# Altium schematic sheet 2_MICROCONTROLADOR.SchDoc
size Tabloid; SheetNumber: 2; SheetTotal: 3; SPICEModelCacheCXJGCLTJ: <root> / <DocumentId>CXJGCLTJ</DocumentId> / </root>
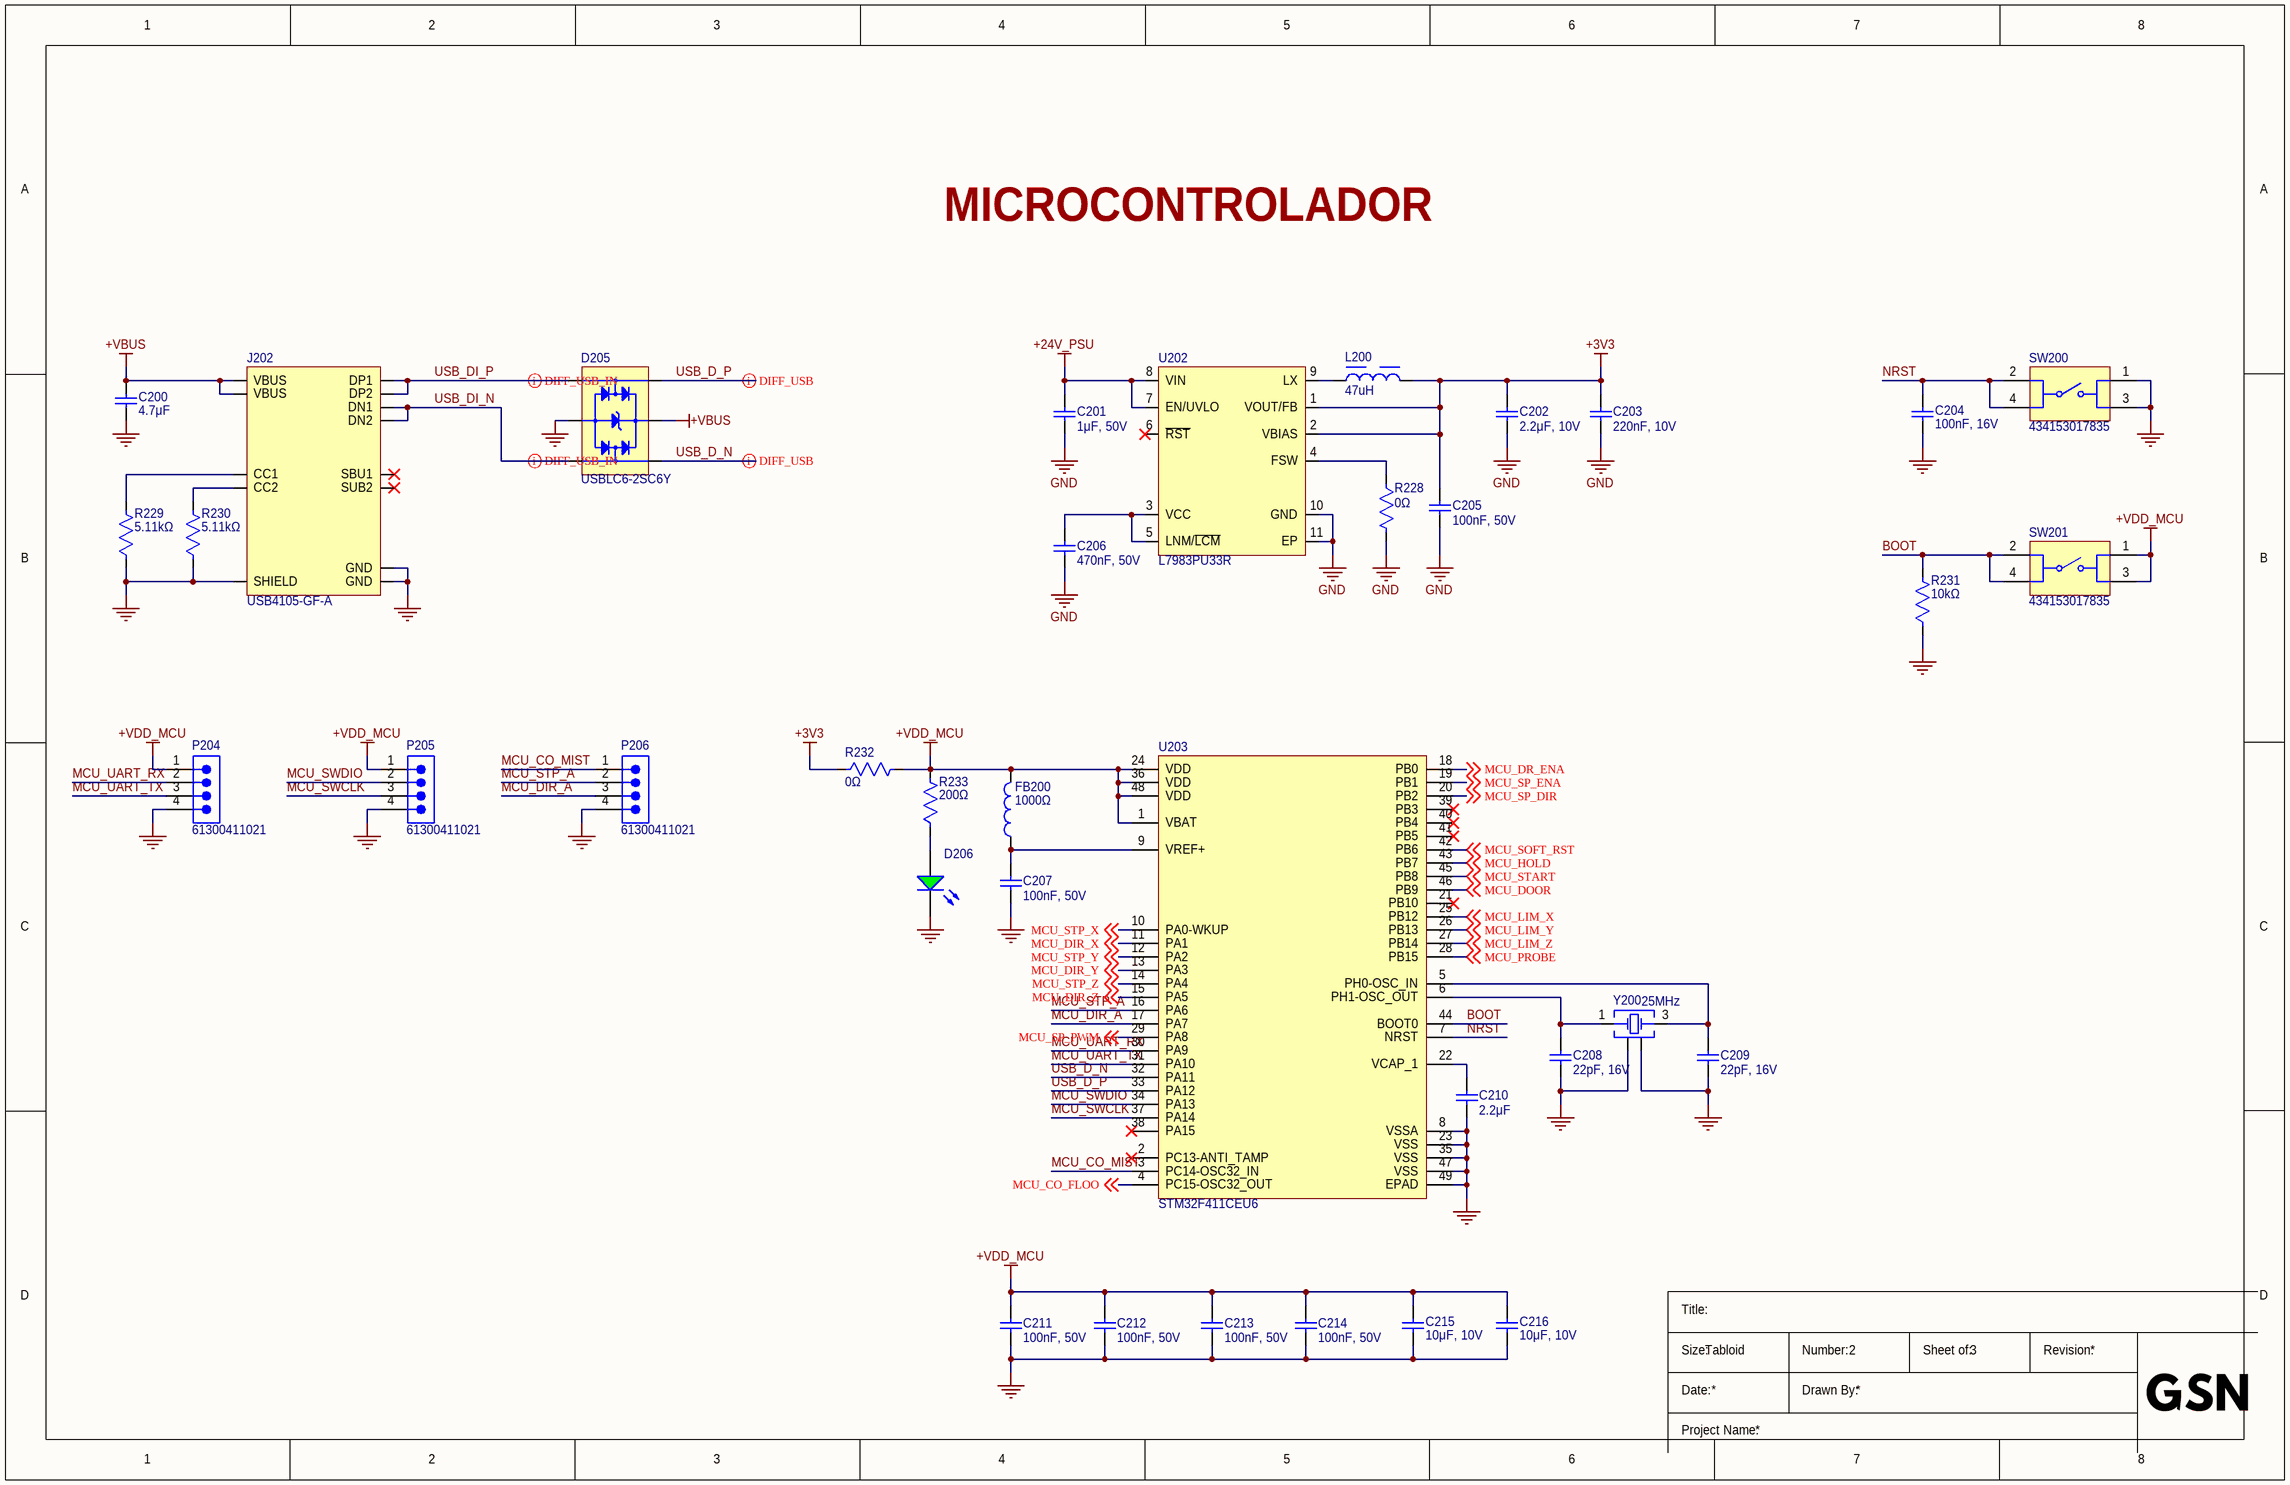
[diagram p0: 2_MICROCONTROLADOR.SchDoc]

## Parts
C200  4.7μF  [WCAP-CSGP_0805_L2W1.25H1.25]
C201  1μF, 50V  [WCAP-CSGP_0805_L2W1.25H1.25]
C202  2.2μF, 10V  [WCAP-CSGP_0603_L1.6W0.8H0.8_Wave]
C203  220nF, 10V  [WCAP-CSGP_0603_L1.6W0.8H0.8_Wave]
C204  100nF, 16V  [WCAP-CSGP_0603_L1.6W0.8H0.8_Wave]
C205  100nF, 50V  [WCAP-CSGP_0603_L1.6W0.8H0.8_Wave]
C206  470nF, 50V  [WCAP-CSGP_0805_L2W1.25H1.25]
C207  100nF, 50V  [WCAP-CSGP_0603_L1.6W0.8H0.8_Wave]
C208  22pF, 16V  [WCAP-CSGP_0603_L1.6W0.8H0.8_Wave]
C209  22pF, 16V  [WCAP-CSGP_0603_L1.6W0.8H0.8_Wave]
C210  2.2μF  [WCAP-CSGP_0603_L1.6W0.8H0.8_Wave]
C211  100nF, 50V  [WCAP-CSGP_0603_L1.6W0.8H0.8_Wave]
C212  100nF, 50V  [WCAP-CSGP_0603_L1.6W0.8H0.8_Wave]
C213  100nF, 50V  [WCAP-CSGP_0603_L1.6W0.8H0.8_Wave]
C214  100nF, 50V  [WCAP-CSGP_0603_L1.6W0.8H0.8_Wave]
C215  10μF, 10V  [WCAP-CSGP_0805_L2W1.25H1.25]
C216  10μF, 10V  [WCAP-CSGP_0805_L2W1.25H1.25]
D205  USBLC6-2SC6Y  [SOT-23-6]
D206  Bright Green, 2V, 140deg  [WL-SMCW_0603_150060xx75000]  (value not drawn)
FB200  1000Ω  [WE-CBF_0603_L1.6W0.8H0.8_HS_WB]
J202  USB4105-GF-A  [USB4105-GF-A]
L200  47uH  [WE-MAIA_3015]
P204  61300411021  [61300411021]
P205  61300411021  [61300411021]
P206  61300411021  [61300411021]
R228  0Ω  [0603-WAVE]
R229  5.11kΩ  [0603-WAVE]
R230  5.11kΩ  [0603-WAVE]
R231  10kΩ  [0603-WAVE]
R232  0Ω  [0805-WAVE]
R233  200Ω  [0603-WAVE]
SW200  434153017835  [434153017835]
SW201  434153017835  [434153017835]
U202  L7983PU33R  [10-WFDFN-EP]
U203  STM32F411CEU6  [UFQFN-48-7X7_EXPOSED_PAD]
Y200  25MHz  [WE-XTAL_CFPX-180]

## Nets
+3V3: C202.2 C203.2 C205.2 L200.2 R232.1 U202.1(VOUT/FB) U202.2(VBIAS)
+24V_PSU: C201.2 U202.7(EN/UVLO) U202.8(VIN)
+VBUS: C200.2 D205.5(VBUS) J202.A4_B9(VBUS) J202.B4_A9(VBUS)
+VDD_MCU: C211.2 C212.2 C213.2 C214.2 C215.2 C216.2 FB200.2 P204.1 P205.1 R232.2 R233.2 SW201.1 SW201.3 U203.1(VBAT) U203.24(VDD) U203.36(VDD) U203.48(VDD)
GND: C200.1 C201.1 C202.1 C203.1 C204.1 C205.1 C206.1 C207.1 C208.1 C209.1 C210.1 C211.1 C212.1 C213.1 C214.1 C215.1 C216.1 D205.2(GND) D206.1(K) J202.A1_B12(GND) J202.B1_A12(GND) J202.SH(SHIELD) P204.4 P205.4 P206.4 R228.2 R229.1 R230.1 R231.1 SW200.1 SW200.3 U202.10(GND) U202.11(EP) U203.8(VSSA) U203.23(VSS) U203.35(VSS) U203.47(VSS) U203.49(EPAD) Y200.2(GND&Lid) Y200.4(GND&Lid)
BOOT: R231.2 SW201.2 SW201.4 U203.44(BOOT0)
MCU_CO_FLOO: U203.4(PC15-OSC32_OUT) ; off-sheet MCU_CO_FLOO
MCU_CO_MIST: P206.1 U203.3(PC14-OSC32_IN)
MCU_DIR_A: P206.3 U203.17(PA7)
MCU_DIR_X: U203.11(PA1) ; off-sheet MCU_DIR_X
MCU_DIR_Y: U203.13(PA3) ; off-sheet MCU_DIR_Y
MCU_DIR_Z: U203.15(PA5) ; off-sheet MCU_DIR_Z
MCU_DOOR: U203.46(PB9) ; off-sheet MCU_DOOR
MCU_DR_ENA: U203.18(PB0) ; off-sheet MCU_DR_ENA
MCU_HOLD: U203.43(PB7) ; off-sheet MCU_HOLD
MCU_LIM_X: U203.25(PB12) ; off-sheet MCU_LIM_X
MCU_LIM_Y: U203.26(PB13) ; off-sheet MCU_LIM_Y
MCU_LIM_Z: U203.27(PB14) ; off-sheet MCU_LIM_Z
MCU_PROBE: U203.28(PB15) ; off-sheet MCU_PROBE
MCU_SOFT_RST: U203.42(PB6) ; off-sheet MCU_SOFT_RST
MCU_SP_DIR: U203.20(PB2) ; off-sheet MCU_SP_DIR
MCU_SP_ENA: U203.19(PB1) ; off-sheet MCU_SP_ENA
MCU_SP_PWM: U203.29(PA8) ; off-sheet MCU_SP_PWM
MCU_START: U203.45(PB8) ; off-sheet MCU_START
MCU_STP_A: P206.2 U203.16(PA6)
MCU_STP_X: U203.10(PA0-WKUP) ; off-sheet MCU_STP_X
MCU_STP_Y: U203.12(PA2) ; off-sheet MCU_STP_Y
MCU_STP_Z: U203.14(PA4) ; off-sheet MCU_STP_Z
MCU_SWCLK: P205.3 U203.37(PA14)
MCU_SWDIO: P205.2 U203.34(PA13)
MCU_UART_RX: P204.2 U203.30(PA9)
MCU_UART_TX: P204.3 U203.31(PA10)
NRST: C204.2 SW200.2 SW200.4 U203.7(NRST)
USB_D_N: D205.4(IO2) U203.32(PA11)
USB_D_P: D205.6(IO1) U203.33(PA12)
USB_DI_N: D205.3(IO2) J202.A7(DN1) J202.B7(DN2)
USB_DI_P: D205.1(IO1) J202.A6(DP1) J202.B6(DP2)
NetC206_2: C206.2 U202.3(VCC) U202.5(LNM/~{LCM})
NetC207_2: C207.2 FB200.1 U203.9(VREF+)
NetC208_2: C208.2 U203.6(PH1-OSC_OUT) Y200.1(Crystal)
NetC209_2: C209.2 U203.5(PH0-OSC_IN) Y200.3(Crystal)
NetC210_2: C210.2 U203.22(VCAP_1)
NetD206_2: D206.2(A) R233.1
NetJ202_A5: J202.A5(CC1) R229.2
NetJ202_B5: J202.B5(CC2) R230.2
NetL200_1: L200.1 U202.9(LX)
NetR228_1: R228.1 U202.4(FSW)

Not connected (* = marked no-connect by the designer): J202 A8(SBU1)* B8(SUB2)*; U202 6(~{RST})*; U203 2(PC13-ANTI_TAMP)* 21(PB10)* 38(PA15)* 39(PB3)* 40(PB4)* 41(PB5)*

## Layout directives
differential pair; differential pair class USB: USB_D_N, USB_D_P, USB_DI_N, USB_DI_P

## Notes on the sheet
- MICROCONTROLADOR
- Title:
- Size:
- Tabloid
- Number:
- Sheet of:
- Revision:
- Date:
- Project Name:
- Drawn By:

## Library data of the parts
C200 = 885012207053: WCAP-CSGP Multilayer Ceramic Chip Capacitor, General Purpose, size 0805, 4.7μF, 16V; Manufacturer: Wurth Elektronik; Case/Size Code: 0805; Capacitance: 4.7uF; Capacitance Tolerance: +/-10%; Ceramic Type: X7R; Dissipation Factor: 10%; Insulation Resistance: 0.02Gohm; Technical Reference: X7R0805475K016DFCT10000; Manufacturer Part Number: 885012207053; Category: Multilayer Ceramic Chip Capacitors; Match Code: WCAP-CSGP; ComponentLink1Description: Website Link; ComponentLink1URL: https://www.we-online.com/redexpert/article/885012207053?ad; ComponentLink2Description: Datasheet Link; ComponentLink2URL: https://www.we-online.com/redexpert/spec/885012207053?ad; Mount: Surface Mount; Packaging: Tape and Reel; Length: 2mm; Width: 1.25mm; Height: 1.25mm; Rated Voltage (DC): 16V; Operating Temperature Min: -55degC; Operating Temperature Max: 125degC
C201 = 885012207103R: WCAP-CSGP Multilayer Ceramic Chip Capacitor, General Purpose, size 0805, 1μF, 50V; Manufacturer: Wurth Elektronik; Case/Size Code: 0805; Capacitance: 1uF; Capacitance Tolerance: +/-10%; Ceramic Type: X7R; Dissipation Factor: 10%; Insulation Resistance: 0.1Gohm; Technical Reference: X7R0805105K050DFCT20000; Manufacturer Part Number: 885012207103R; Category: Multilayer Ceramic Chip Capacitors; Match Code: WCAP-CSGP; ComponentLink1Description: Website Link; ComponentLink1URL: https://www.we-online.com/redexpert/article/885012207103R?ad; ComponentLink2Description: Datasheet Link; ComponentLink2URL: https://www.we-online.com/redexpert/spec/885012207103R?ad; Mount: Surface Mount; Operating Temperature Min: -55degC; Operating Temperature Max: 125degC; Packaging: Tape and Reel; Length: 2mm; Width: 1.25mm; Height: 1.25mm; Rated Voltage (DC): 50V
C202 = 885012206027: WCAP-CSGP Multilayer Ceramic Chip Capacitor, General Purpose, size 0603, 2.2μF, 10V; Manufacturer: Wurth Elektronik; Case/Size Code: 0603; Capacitance: 2.2uF; Capacitance Tolerance: +/-10%; Ceramic Type: X7R; Dissipation Factor: 10%; Insulation Resistance: 0.02Gohm; Technical Reference: X7R0603225K010DFCT10000; Manufacturer Part Number: 885012206027; Category: Multilayer Ceramic Chip Capacitors; Match Code: WCAP-CSGP; ComponentLink1Description: Website Link; ComponentLink1URL: https://www.we-online.com/redexpert/article/885012206027?ad; ComponentLink2Description: Datasheet Link; ComponentLink2URL: https://www.we-online.com/redexpert/spec/885012206027?ad; Mount: Surface Mount; Operating Temperature Min: -55degC; Operating Temperature Max: 125degC; Packaging: Tape and Reel; Length: 1.6mm; Width: 0.8mm; Height: 0.8mm; Rated Voltage (DC): 10V
C203 = 885012206022: WCAP-CSGP Multilayer Ceramic Chip Capacitor, General Purpose, size 0603, 220nF, 10V; Manufacturer: Wurth Elektronik; Case/Size Code: 0603; Capacitance Tolerance: +/-10%; Ceramic Type: X7R; Dissipation Factor: 5%; Insulation Resistance: 2.3Gohm; Technical Reference: X7R0603224K010DFCT10000; Manufacturer Part Number: 885012206022; Category: Multilayer Ceramic Chip Capacitors; Match Code: WCAP-CSGP; ComponentLink1Description: Website Link; ComponentLink1URL: https://www.we-online.com/redexpert/article/885012206022?ad; ComponentLink2Description: Datasheet Link; ComponentLink2URL: https://www.we-online.com/redexpert/spec/885012206022?ad; Mount: Surface Mount; Operating Temperature Min: -55degC; Operating Temperature Max: 125degC; Packaging: Tape and Reel; Length: 1.6mm; Width: 0.8mm; Height: 0.8mm; Capacitance: 220nF; Rated Voltage (DC): 10V
C204 = 885012206046: WCAP-CSGP Multilayer Ceramic Chip Capacitor, General Purpose, size 0603, 100nF, 16V; Manufacturer: Wurth Elektronik; Case/Size Code: 0603; Capacitance Tolerance: +/-10%; Ceramic Type: X7R; Dissipation Factor: 3.5%; Insulation Resistance: 5Gohm; Technical Reference: X7R0603104K016DFCT10000; Manufacturer Part Number: 885012206046; Category: Multilayer Ceramic Chip Capacitors; Match Code: WCAP-CSGP; ComponentLink1Description: Website Link; ComponentLink1URL: https://www.we-online.com/redexpert/article/885012206046?ad; ComponentLink2Description: Datasheet Link; ComponentLink2URL: https://www.we-online.com/redexpert/spec/885012206046?ad; Mount: Surface Mount; Packaging: Tape and Reel; Length: 1.6mm; Width: 0.8mm; Height: 0.8mm; Capacitance: 100nF; Rated Voltage (DC): 16V; Operating Temperature Min: -55degC; Operating Temperature Max: 125degC
C205 C207 C211-C214 = 885012206095: WCAP-CSGP Multilayer Ceramic Chip Capacitor, General Purpose, size 0603, 100nF, 50V; Manufacturer: Wurth Elektronik; Case/Size Code: 0603; Capacitance Tolerance: +/-10%; Ceramic Type: X7R; Dissipation Factor: 3%; Insulation Resistance: 5Gohm; Technical Reference: X7R0603104K050DFCT10000; Manufacturer Part Number: 885012206095; Category: Multilayer Ceramic Chip Capacitors; Match Code: WCAP-CSGP; ComponentLink1Description: Website Link; ComponentLink1URL: https://www.we-online.com/redexpert/article/885012206095?ad; ComponentLink2Description: Datasheet Link; ComponentLink2URL: https://www.we-online.com/redexpert/spec/885012206095?ad; Mount: Surface Mount; Operating Temperature Min: -55degC; Operating Temperature Max: 125degC; Packaging: Tape and Reel; Length: 1.6mm; Width: 0.8mm; Height: 0.8mm; Capacitance: 100nF; Rated Voltage (DC): 50V
C206 = 885012207102: WCAP-CSGP Multilayer Ceramic Chip Capacitor, General Purpose, size 0805, 470nF, 50V; Manufacturer: Wurth Elektronik; Case/Size Code: 0805; Capacitance Tolerance: +/-10%; Ceramic Type: X7R; Dissipation Factor: 3%; Insulation Resistance: 1.1Gohm; Technical Reference: X7R0805474K050DFCT10000; Manufacturer Part Number: 885012207102; Category: Multilayer Ceramic Chip Capacitors; Match Code: WCAP-CSGP; ComponentLink1Description: Website Link; ComponentLink1URL: https://www.we-online.com/redexpert/article/885012207102?ad; ComponentLink2Description: Datasheet Link; ComponentLink2URL: https://www.we-online.com/redexpert/spec/885012207102?ad; Mount: Surface Mount; Operating Temperature Min: -55degC; Operating Temperature Max: 125degC; Packaging: Tape and Reel; Length: 2mm; Width: 1.25mm; Height: 1.25mm; Capacitance: 470nF; Rated Voltage (DC): 50V
C208 C209 = 885012006019: WCAP-CSGP Multilayer Ceramic Chip Capacitor, General Purpose, size 0603, 22pF, 16V; Manufacturer: Wurth Elektronik; Case/Size Code: 0603; Capacitance Tolerance: +/-5%; Ceramic Type: NP0; Insulation Resistance: 10Gohm; Q Factor: 840; Technical Reference: NP00603220J016DFCT10000; Manufacturer Part Number: 885012006019; Category: Multilayer Ceramic Chip Capacitors; Match Code: WCAP-CSGP; ComponentLink1Description: Website Link; ComponentLink1URL: https://www.we-online.com/redexpert/article/885012006019?ad; ComponentLink2Description: Datasheet Link; ComponentLink2URL: https://www.we-online.com/redexpert/spec/885012006019?ad; Mount: Surface Mount; Operating Temperature Min: -55degC; Operating Temperature Max: 125degC; Packaging: Tape and Reel; Length: 1.6mm; Width: 0.8mm; Height: 0.8mm; Capacitance: 22pF; Rated Voltage (DC): 16V
C210 = 885012106004: WCAP-CSGP Multilayer Ceramic Chip Capacitor, General Purpose, size 0603, 2.2μF, 6.3V; Manufacturer: Wurth Elektronik; Case/Size Code: 0603; Capacitance: 2.2uF; Capacitance Tolerance: +/-20%; Ceramic Type: X5R; Dissipation Factor: 10%; Insulation Resistance: 0.05Gohm; Technical Reference: X5R0603225M6R3DFCT10000; Manufacturer Part Number: 885012106004; Category: Multilayer Ceramic Chip Capacitors; Match Code: WCAP-CSGP; ComponentLink1Description: Website Link; ComponentLink1URL: https://www.we-online.com/redexpert/article/885012106004?ad; ComponentLink2Description: Datasheet Link; ComponentLink2URL: https://www.we-online.com/redexpert/spec/885012106004?ad; Mount: Surface Mount; Packaging: Tape and Reel; Length: 1.6mm; Width: 0.8mm; Height: 0.8mm; Rated Voltage (DC): 6.3V; Operating Temperature Min: -55degC; Operating Temperature Max: 85degC
C215 C216 = 885012207026: WCAP-CSGP Multilayer Ceramic Chip Capacitor, General Purpose, size 0805, 10μF, 10V; Manufacturer: Wurth Elektronik; Case/Size Code: 0805; Capacitance: 10uF; Capacitance Tolerance: +/-10%; Ceramic Type: X7R; Dissipation Factor: 10%; Insulation Resistance: 0.01Gohm; Technical Reference: X7R0805106K010DFCT10000; Manufacturer Part Number: 885012207026; Category: Multilayer Ceramic Chip Capacitors; Match Code: WCAP-CSGP; ComponentLink1Description: Website Link; ComponentLink1URL: https://www.we-online.com/redexpert/article/885012207026?ad; ComponentLink2Description: Datasheet Link; ComponentLink2URL: https://www.we-online.com/redexpert/spec/885012207026?ad; Mount: Surface Mount; Packaging: Tape and Reel; Length: 2mm; Width: 1.25mm; Height: 1.25mm; Rated Voltage (DC): 10V; Operating Temperature Min: -55degC; Operating Temperature Max: 125degC
D205 = USBLC6-2SC6Y: TVS DIODE 5.25VWM 17VC SOT23-6; Manufacturer: STMicroelectronics; Breakdown Voltage: 6V; Value: 2.5pF; Clamping Voltage: 17V; Direction: Unidirectional; Element Configuration: Dual; ESD Protection: Yes; Forward Voltage: 860mV; Leakage Current: 150nA; Max Junction Temperature (Tj): 150°C; Number of Bidirectional Channels: 2; Number of Elements: 1; Operating Supply Voltage: 1.1V; Peak Pulse Current: 5A; Reverse Standoff Voltage: 5.25V; ESR: 330Ω; Test Current: 1mA; Supplier: DigiKey; Supplier Part Number: 497-11882-1-ND; Manufacturer Part Number: USBLC6-2SC6Y; RoHS: Compliant; Category: TVS Diodes; Stock: 64605; Pricing: 1=0.46, 10=0.298, 100=0.211, 500=0.164, 1000=0.144 (USD); Case/Package: SOT-23-6; China RoHS: Compliant; Depth: 1.75mm; Height: 1.45mm; Lead Free: Lead Free; Length: 3mm; Lifecycle Status: Production; Max Operating Temperature: 150°C; Max Reverse Leakage Current: 150nA; Min Breakdown Voltage: 6V; Min Operating Temperature: -40°C; Mounting Technology: Surface Mount; Number of Channels: 2; Pins: 6; Number of Terminals: 6; Packaging: Tape and Reel; Peak Reverse Current: 150nA; Polarity: Unidirectional; Power Line Protection: Yes; Radiation Hardening: No; REACH SVHC: Yes; Schedule B: 8536300000, 8536300000|8536300000|8536300000|8536300000|8536300000; Termination: SMD/SMT; Width: 1.75mm; ComponentLink1URL: https://datasheet.octopart.com:443/USBLC6-2SC6Y-STMicroelectronics-datasheet-12533815.pdf?src-supplier=ODG+(Origin+Data+Global); ComponentLink1Description: https://datasheet.octopart.com:443/USBLC6-2SC6Y-STMicroelectronics-datasheet-12533815.pdf?src-supplier=ODG+(Origin+Data+Global); ComponentLink2URL: https://datasheet.octopart.com:443/USBLC6-2SC6Y-STMicroelectronics-datasheet-13733956.pdf?src-supplier=STMicroelectronics; ComponentLink2Description: https://datasheet.octopart.com:443/USBLC6-2SC6Y-STMicroelectronics-datasheet-13733956.pdf?src-supplier=STMicroelectronics; ComponentLink3URL: https://datasheet.octopart.com:443/USBLC6-2SC6Y-STMicroelectronics-datasheet-10412581.pdf?src-supplier=Factory+Futures; ComponentLink3Description: https://datasheet.octopart.com:443/USBLC6-2SC6Y-STMicroelectronics-datasheet-10412581.pdf?src-supplier=Factory+Futures; ComponentLink4URL: https://datasheet.octopart.com:443/USBLC6-2SC6Y-STMicroelectronics-datasheet-525477.pdf?src-supplier=Factory+Futures; ComponentLink4Description: https://datasheet.octopart.com:443/USBLC6-2SC6Y-STMicroelectronics-datasheet-525477.pdf?src-supplier=Factory+Futures
D206 = 150060VS75000: WL-SMCW Mono-color Chip LED Waterclear, SMT, size 0603, Bright Green, 2V, 140°; Manufacturer: Wurth Elektronik; Case/Size Code: 0603; Chip Technology: AlInGaP; Dominant Wavelength: 570nm; Luminous Intensity: 40mcd; Peak Wavelength: 572nm; Manufacturer Part Number: 150060VS75000; Category: Signal LEDs; Match Code: WL-SMCW; ComponentLink1Description: Website Link; ComponentLink1URL: https://www.we-online.com/redexpert/article/150060VS75000?ad; ComponentLink2Description: Datasheet Link; ComponentLink2URL: https://www.we-online.com/redexpert/spec/150060VS75000?ad; Mount: Surface Mount; Packaging: Tape and Reel; Length: 1.6mm; Width: 0.8mm; Height: 0.7mm; Emitting Color: Bright Green; Forward Voltage: 2V; Viewing Angle: 140deg; Operating Temperature Min: -40degC; Operating Temperature Max: 85degC
FB200 = 74279266: WE-CBF SMT EMI Suppression Ferrite Bead, size 0603, 1000Ω, 0.65A; Manufacturer: Wurth Elektronik; Case/Size Code: 0603; DC Resistance Max: 0.6Ω; Impedance Max: 1350Ω; Impedance Max Test Condition: 140MHz; Type: Wide Band; Manufacturer Part Number: 74279266; Category: Ferrites for PCB Assembly; Match Code: WE-CBF; ComponentLink1Description: Website Link; ComponentLink1URL: https://www.we-online.com/redexpert/article/74279266?ad; ComponentLink2Description: Datasheet Link; ComponentLink2URL: https://www.we-online.com/redexpert/spec/74279266?ad; Mount: Surface Mount; Packaging: Tape and Reel; Length: 1.6mm; Width: 0.8mm; Height: 0.8mm; Impedance @100MHz: 1000Ω; Rated Current: 0.65A; Operating Temperature Min: -55degC; Operating Temperature Max: 125degC
J202 = USB4105-GF-A: CONN RCP USB2.0 TYP C 16P SMD RA; Manufacturer: Global Connector Technology; Contact Resistance: 50mΩ; Current Rating: 6.25A; Dielectric Material: Liquid Crystal Polymer; Gender: Receptacle; Insulation Resistance: 100MΩ; Number of Contacts: 16; Number of Ports: 1; Voltage Rating: 20V; Supplier: DigiKey; Supplier Part Number: 2073-USB4105-GF-ACT-ND; Manufacturer Part Number: USB4105-GF-A; RoHS: Compliant; Category: USB Connectors; Stock: 6325; Pricing: 1=0.78, 10=0.658, 25=0.6172, 50=0.5876, 100=0.5595, 250=0.5244 (USD); China RoHS: Compliant; Contact Gender: Female; Contact Material: Gold, Nickel; Height: 3.46mm; Lifecycle Status: Production; Max Operating Temperature: 85°C; Min Operating Temperature: -40°C; Pins: 24; Number of Rows: 1; Orientation: Horizontal; REACH SVHC: Yes; Shell Finish: Nickel; Shell Material: Stainless Steel; Terminal Pitch: 500µm; USB Standard: USB 2.0; ComponentLink1URL: https://datasheet.octopart.com:443/USB4105-GF-A-GCT-datasheet-166929323.pdf?src-supplier=SOS+electronic; ComponentLink1Description: https://datasheet.octopart.com:443/USB4105-GF-A-GCT-datasheet-166929323.pdf?src-supplier=SOS+electronic; ComponentLink2URL: https://datasheet.octopart.com:443/USB4105-GF-A-GCT-datasheet-188935996.pdf?src-supplier=TME; ComponentLink2Description: https://datasheet.octopart.com:443/USB4105-GF-A-GCT-datasheet-188935996.pdf?src-supplier=TME; ComponentLink3URL: https://datasheet.octopart.com:443/USB4105-GF-A-GCT-datasheet-188869076.pdf?src-supplier=TME; ComponentLink3Description: https://datasheet.octopart.com:443/USB4105-GF-A-GCT-datasheet-188869076.pdf?src-supplier=TME; ComponentLink4URL: https://datasheet.octopart.com:443/USB4105-GF-A-GCT-datasheet-166927665.pdf?src-supplier=TME; ComponentLink4Description: https://datasheet.octopart.com:443/USB4105-GF-A-GCT-datasheet-166927665.pdf?src-supplier=TME
L200 = 78438335470: WE-MAIA SMT Power Inductor, size 3015, 47uH, 0.5A, 2300mohm; Manufacturer: Wurth Elektronik; Case/Size Code: 3015; Saturation Current @ 10%: 0.75A; Saturation Current @ 30%: 1.5A; Self Resonant Frequency: 8MHz; Manufacturer Part Number: 78438335470; Category: Power Inductors; Match Code: WE-MAIA; ComponentLink1Description: Website Link; ComponentLink1URL: https://www.we-online.com/redexpert/article/78438335470?ad; ComponentLink2Description: Datasheet Link; ComponentLink2URL: https://www.we-online.com/redexpert/spec/78438335470?ad; Mount: Surface Mount; Operating Temperature Min: -40degC; Operating Temperature Max: 125degC; Packaging: Tape and Reel; Length: 3mm; Width: 3mm; Height: 1.5mm; Automotive: Yes; DC Resistance Max: 2300mohm; Inductance: 47uH; Rated Current: 0.5A
P204-P206 = 61300411021: WR-PHD Pin Header, THT, Angled, pitch 2.54mm, 1 Row, 4P; Manufacturer: Wurth Elektronik; Contact Resistance: 20mOhm; Rated Current: 3A; Working Voltage: 250V; Withstanding Voltage: 500V; Manufacturer Part Number: 61300411021; Category: Board-to-Board Connectors; Match Code: WR-PHD; ComponentLink1Description: Website Link; ComponentLink1URL: https://www.we-online.com/redexpert/article/61300411021?ad; ComponentLink2Description: Datasheet Link; ComponentLink2URL: https://www.we-online.com/redexpert/spec/61300411021?ad; Mount: Through Hole; Operating Temperature Min: -40degC; Operating Temperature Max: 105degC; Packaging: Bag; Gender: Pin Header; Number of Pins: 4; Number of Rows: 1; Orientation: Angled; Lead Pitch: 2.54mm
R228 = RC0603FR-070RL: RES 0 OHM 1% 1/10W 0603; Manufacturer: Yageo Group; Max Power Dissipation: 100mW; Temperature Coefficient: ±200ppm/°C; Voltage Rating (AC): 50V; Voltage Rating: 75V; Supplier Part Number: 311-0.0HRCT-ND; Manufacturer Part Number: RC0603FR-070RL; Value: 0Ω; Case Code (Imperial): 0603; Case Code (Metric): 1608; Case/Package: 0603; Category: Chip SMD Resistors; China RoHS: Non-Compliant; Composition: Thick Film; Contact Plating: Tin; Depth: 800µm; Features: Moisture Resistant; Height: 450µm; Lead Free: Lead Free; Length: 1.6mm; Lifecycle Status: Production; Max Operating Temperature: 155°C; Military Standard: Not; Min Operating Temperature: -55°C; Mounting Technology: Surface Mount; Number of Terminals: 2; Number of Terminations: 2; Packaging: Tape & Reel; Power Dissipation: 100mW; Power Rating: 100mW; Radiation Hardening: No; REACH SVHC: Yes; RoHS: Compliant; Supplier: DigiKey; Termination: SMD/SMT; Tolerance: 1%; Component Link Description: https://www.yageogroup.com/content/datasheet/asset/file/PYU-RC_GROUP_51_ROHS_L; Component Link URL: https://www.yageogroup.com/content/datasheet/asset/file/PYU-RC_GROUP_51_ROHS_L; Datasheet: https://www.yageogroup.com/content/datasheet/asset/file/PYU-RC_GROUP_51_ROHS_L; Voltage Rating (DC): 50V; Weight: 2.012816mg; Width: 800µm; Working Voltage: 75V
R229 R230 = RC0603FR-075K11L: RES 5.11K OHM 1% 1/10W 0603; Manufacturer: Yageo Group; Max Power Dissipation: 100mW; Temperature Coefficient: ±200ppm/°C; Voltage Rating (AC): 50V; Voltage Rating: 75V; Supplier Part Number: 311-5.11KHRCT-ND; Manufacturer Part Number: RC0603FR-075K11L; Value: 5.11kΩ; Case Code (Imperial): 0603; Case Code (Metric): 1608; Case/Package: 0603; Category: Chip SMD Resistors; China RoHS: Non-Compliant; Composition: Thick Film; Contact Plating: Tin; Depth: 800µm; Features: Moisture Resistant; Height: 450µm; Lead Free: Lead Free; Length: 1.6mm; Lifecycle Status: Production; Max Operating Temperature: 155°C; Military Standard: Not; Min Operating Temperature: -55°C; Mounting Technology: Surface Mount; Number of Terminals: 2; Number of Terminations: 2; Packaging: Tape & Reel; Power Dissipation: 100mW; Power Rating: 100mW; Radiation Hardening: No; REACH SVHC: Yes; RoHS: Compliant; Supplier: DigiKey; Termination: SMD/SMT; Tolerance: 1%; Component Link Description: https://www.yageogroup.com/content/datasheet/asset/file/PYU-RC_GROUP_51_ROHS_L; Component Link URL: https://www.yageogroup.com/content/datasheet/asset/file/PYU-RC_GROUP_51_ROHS_L; Datasheet: https://www.yageogroup.com/content/datasheet/asset/file/PYU-RC_GROUP_51_ROHS_L; Voltage Rating (DC): 50V; Weight: 2.012816mg; Width: 800µm; Working Voltage: 75V
R231 = RC0603FR-0710KL: RES 10K OHM 1% 1/10W 0603; Manufacturer: Yageo Group; Max Power Dissipation: 100mW; Temperature Coefficient: ±200ppm/°C; Voltage Rating (AC): 50V; Voltage Rating: 75V; Supplier Part Number: 311-10.0KHRCT-ND; Manufacturer Part Number: RC0603FR-0710KL; Value: 10kΩ; Case Code (Imperial): 0603; Case Code (Metric): 1608; Case/Package: 0603; Category: Chip SMD Resistors; China RoHS: Non-Compliant; Composition: Thick Film; Contact Plating: Tin; Depth: 800µm; Features: Moisture Resistant; Height: 450µm; Lead Free: Lead Free; Length: 1.6mm; Lifecycle Status: Production; Max Operating Temperature: 155°C; Military Standard: Not; Min Operating Temperature: -55°C; Mounting Technology: Surface Mount; Number of Terminals: 2; Number of Terminations: 2; Packaging: Tape & Reel; Power Dissipation: 100mW; Power Rating: 100mW; Radiation Hardening: No; REACH SVHC: Yes; RoHS: Compliant; Supplier: DigiKey; Termination: SMD/SMT; Tolerance: 1%; Component Link Description: https://www.yageogroup.com/content/datasheet/asset/file/PYU-RC_GROUP_51_ROHS_L; Component Link URL: https://www.yageogroup.com/content/datasheet/asset/file/PYU-RC_GROUP_51_ROHS_L; Datasheet: https://www.yageogroup.com/content/datasheet/asset/file/PYU-RC_GROUP_51_ROHS_L; Voltage Rating (DC): 50V; Weight: 2.012816mg; Width: 800µm; Working Voltage: 75V
R232 = RC0805FR-070RL: RES 0 OHM 1% 1/8W 0805; Manufacturer: Yageo Group; Power Dissipation: 125mW; Temperature Coefficient: 100ppm/°C; Voltage Rating: 150V; Supplier: DigiKey; Supplier Part Number: 311-0.0CRCT-ND; Manufacturer Part Number: RC0805FR-070RL; RoHS: Compliant; Category: Chip SMD Resistors; Stock: 748818; Pricing: 1=0.1, 10=0.017, 25=0.0144, 50=0.0124, 100=0.0109, 250=0.00916, 500=0.00808, 1000=0.00715 (USD); Case/Package: 0805; China RoHS: Non-Compliant; Composition: Thick Film; Contact Plating: Tin; Depth: 1.25mm; Height: 500µm; Lead Free: Lead Free; Length: 2mm; Lifecycle Status: Production; Max Operating Temperature: 155°C; Military Standard: Not; Min Operating Temperature: -55°C; Mounting Technology: Surface Mount; Number of Terminals: 2; Power Rating: 125mW; Radiation Hardening: No; REACH SVHC: Yes; Value: 0Ω; Tolerance: 1%; Width: 1.25mm; ComponentLink1URL: https://datasheet.octopart.com:443/RC0805FR-070RL-Yageo-datasheet-127823281.pdf?src-supplier=Upverter; ComponentLink1Description: https://datasheet.octopart.com:443/RC0805FR-070RL-Yageo-datasheet-127823281.pdf?src-supplier=Upverter; ComponentLink2URL: https://datasheet.octopart.com:443/RC0805FR-070RL-Yageo-datasheet-17879891.pdf?src-supplier=IHS; ComponentLink2Description: https://datasheet.octopart.com:443/RC0805FR-070RL-Yageo-datasheet-17879891.pdf?src-supplier=IHS; ComponentLink3URL: https://datasheet.octopart.com:443/RC0805FR-070RL-Yageo-datasheet-8330313.pdf?src-supplier=Burklin+Elektronik; ComponentLink3Description: https://datasheet.octopart.com:443/RC0805FR-070RL-Yageo-datasheet-8330313.pdf?src-supplier=Burklin+Elektronik; ComponentLink4URL: https://datasheet.octopart.com:443/RC0805FR-070RL-Yageo-datasheet-164759695.pdf?src-supplier=Future+Electronics; ComponentLink4Description: https://datasheet.octopart.com:443/RC0805FR-070RL-Yageo-datasheet-164759695.pdf?src-supplier=Future+Electronics; ComponentLink5URL: https://datasheet.octopart.com:443/RC0805FR-070RL-Yageo-datasheet-12592811.pdf?src-supplier=Future+Electronics; ComponentLink5Description: https://datasheet.octopart.com:443/RC0805FR-070RL-Yageo-datasheet-12592811.pdf?src-supplier=Future+Electronics; ComponentLink6URL: https://datasheet.octopart.com:443/RC0805FR-070RL-Yageo-datasheet-8324252.pdf?src-supplier=Future+Electronics; ComponentLink6Description: https://datasheet.octopart.com:443/RC0805FR-070RL-Yageo-datasheet-8324252.pdf?src-supplier=Future+Electronics; ComponentLink7URL: https://datasheet.octopart.com:443/RC0805FR-070RL-Yageo-datasheet-141265859.pdf?src-supplier=TME; ComponentLink7Description: https://datasheet.octopart.com:443/RC0805FR-070RL-Yageo-datasheet-141265859.pdf?src-supplier=TME; ComponentLink8URL: https://datasheet.octopart.com/RC0805FR-070RL-Yageo-datasheet-73766026.pdf; ComponentLink8Description: https://datasheet.octopart.com/RC0805FR-070RL-Yageo-datasheet-73766026.pdf; ComponentLink9URL: http://sigma.octopart.com:80/conflict_mineral_statement/Yageo-company-3.pdf?src-supplier=Compliance+Statements; ComponentLink9Description: http://sigma.octopart.com:80/conflict_mineral_statement/Yageo-company-3.pdf?src-supplier=Compliance+Statements; ComponentLink10URL: http://sigma.octopart.com:80/rohs_statement/Yageo-company-2.pdf?src-supplier=Compliance+Statements; ComponentLink10Description: http://sigma.octopart.com:80/rohs_statement/Yageo-company-2.pdf?src-supplier=Compliance+Statements
R233 = RC0603FR-07200RL: RES 200 OHM 1% 1/10W 0603; Manufacturer: Yageo Group; Max Power Dissipation: 100mW; Temperature Coefficient: ±200ppm/°C; Voltage Rating (AC): 50V; Voltage Rating: 75V; Supplier Part Number: 311-200HRCT-ND; Manufacturer Part Number: RC0603FR-07200RL; Value: 200Ω; Case Code (Imperial): 0603; Case Code (Metric): 1608; Case/Package: 0603; Category: Chip SMD Resistors; China RoHS: Non-Compliant; Composition: Thick Film; Contact Plating: Tin; Depth: 800µm; Features: Moisture Resistant; Height: 450µm; Lead Free: Lead Free; Length: 1.6mm; Lifecycle Status: Production; Max Operating Temperature: 155°C; Military Standard: Not; Min Operating Temperature: -55°C; Mounting Technology: Surface Mount; Number of Terminals: 2; Number of Terminations: 2; Packaging: Tape & Reel; Power Dissipation: 100mW; Power Rating: 100mW; Radiation Hardening: No; REACH SVHC: Yes; RoHS: Compliant; Supplier: DigiKey; Termination: SMD/SMT; Tolerance: 1%; Component Link Description: https://www.yageogroup.com/content/datasheet/asset/file/PYU-RC_GROUP_51_ROHS_L; Component Link URL: https://www.yageogroup.com/content/datasheet/asset/file/PYU-RC_GROUP_51_ROHS_L; Datasheet: https://www.yageogroup.com/content/datasheet/asset/file/PYU-RC_GROUP_51_ROHS_L; Voltage Rating (DC): 50V; Weight: 2.012816mg; Width: 800µm; Working Voltage: 75V
SW200 SW201 = 434153017835: WS-TASV J-Bend SMT Tact Switch, 3.5mm x 2.9mm x 1.7mm, SPST-NO, 350gf, 12V, 50mA; Manufacturer: Wurth Elektronik; Washable: No; Manufacturer Part Number: 434153017835; Category: Tact Switch; Match Code: WS-TASV; ComponentLink1Description: Website Link; ComponentLink1URL: https://www.we-online.com; ComponentLink2Description: Datasheet Link; ComponentLink2URL: https://www.we-online.com/components/products/datasheet/434153017835; Mount: Surface Mount; Operating Temperature Min: -40degC; Operating Temperature Max: 85degC; Packaging: Tape and Reel; Length: 3.5mm; Width: 2.9mm; Height: 1.7mm; Circuit: SPST-NO; Contact Material: Stainless Steel; Contact Plating: Silver; Operation Force: 350gf; Rated Current: 50mA; Rated Voltage (DC): 12V; Terminal Material: Copper Alloy; Terminal Plating: Silver
U202 = L7983PU33R: IC REG BUCK 3.3V 300MA 10DFN; Manufacturer: STMicroelectronics; Max Supply Voltage: 60V; Max Switching Frequency: 2.42MHz; Min Input Voltage: 3.5V; Min Output Voltage: 850mV; Nominal Supply Voltage: 24V; Number of Circuits: 1; Quiescent Current: 10µA; Synchronous Rectifier: Yes; Supplier: DigiKey; Supplier Part Number: 497-L7983PU33RCT-ND; Manufacturer Part Number: L7983PU33R; RoHS: Compliant; Category: Voltage Regulators - Switching; Stock: 4366; Pricing: 1=2.69, 10=2.001, 25=1.83, 100=1.6411, 250=1.55108, 500=1.5155 (USD); China RoHS: Compliant; Country of Origin: Mainland China; Export Control Classification Number (ECCN) Code: EAR99; Height - Seated (Max): 800µm; Harmonized Tariff Schedule (HTS) Code: 8542.39.00.60; Introduction Date: 2020-10-06; Length: 3mm; Lifecycle Status: Production; Max Operating Temperature: 150°C; Max Output current: 300mA; Max Output Voltage: 60V; Min Operating Temperature: -40°C; Nominal Output Voltage: 3.3V; Number of Terminals: 10; Output Current: 300mA; Packaging: Tape and Reel; REACH SVHC: Yes; Schedule B: 8542390000, 8542390000|8542390000|8542390000|8542390000|8542390000|8542390000|8542390000|8542390000|8542390000|8542390000|8542390000|8542390000|8542390000|8542390000|8542390000|8542390000|8542390000|8542390000|8542390000|8542390000|8542390000|8542390000|8542390000|85; Terminal Pitch: 500µm; Topology: Buck; Width: 3mm
U203 = STM32F411CEU6: IC MCU 32BIT 512KB FLSH 48UFQFPN; Manufacturer: STMicroelectronics; ADC Channels (Resolution): 10-Ch 12-Bit; Core Architecture: ARM Cortex-M4; Data Bus Width: 32b; EEPROM Memory Size: 0B; Frequency: 100MHz; Interface: SDIO, USB; Clock Frequency: 26MHz; Max Power Dissipation: 625mW; Max Supply Current: 34.5mA; Max Supply Voltage: 3.6V; Memory Format: FLASH; Min Supply Voltage: 1.7V; Nominal Supply Current: 1.8µA; Number of A/D Converters: 1; Number of ADC Channels: 16; Number of Channels: 10; Number of I2C Channels: 3; Number of I/Os: 36; Number of SPI Channels: 5; Number of Timers/Counters: 2; Operating Supply Voltage: 3.3V; Oscillator Type: Internal; Peripherals: POR; RAM Size: 128kB; Watchdog Timer: Yes; Supplier: DigiKey; Supplier Part Number: 497-14907-ND; Manufacturer Part Number: STM32F411CEU6; RoHS: Compliant; Category: Microcontrollers; Stock: 3816; Pricing: 1=6.18, 10=4.745, 25=4.386, 100=3.991, 260=3.79569, 520=3.68344, 1040=3.59105, 2600=3.49353 (USD); Case/Package: UFQFPN; China RoHS: Compliant; Flash Memory Size: 512kB; Height - Seated (Max): 600µm; Lead Free: Lead Free; Length: 7mm; Lifecycle Status: Production; Max Operating Temperature: 85°C; Memory Size: 512kB; Min Operating Temperature: -40°C; Mounting Technology: Surface Mount; Number of Interrupts: 16; Pins: 48; Number of Programmable I/O: 36; Number of Terminals: 48; Number of USART Channels: 3; Packaging: Cut Tape; Radiation Hardening: No; REACH SVHC: Yes; Schedule B: 8542310000, 8542310000|8542310000|8542310000|8542310000|8542310000|8542310000|8542310000|8542310000|8542310000|8542310000|8542310000|8542310000|8542310000|8542310000|8542310000|8542310000|8542310000|8542310000|8542310000|8542310000|8542310000|8542310000|8542310000|85; Terminal Pitch: 500µm; Width: 7mm; ComponentLink1URL: https://datasheet.octopart.com:443/STM32F411CEU6-STMicroelectronics-datasheet-41919523.pdf?src-supplier=element14+APAC; ComponentLink1Description: https://datasheet.octopart.com:443/STM32F411CEU6-STMicroelectronics-datasheet-41919523.pdf?src-supplier=element14+APAC; ComponentLink2URL: https://datasheet.octopart.com:443/STM32F411CEU6-STMicroelectronics-datasheet-27102711.pdf?src-supplier=Upverter; ComponentLink2Description: https://datasheet.octopart.com:443/STM32F411CEU6-STMicroelectronics-datasheet-27102711.pdf?src-supplier=Upverter; ComponentLink3URL: https://datasheet.octopart.com:443/STM32F411CEU6-STMicroelectronics-datasheet-114750309.pdf?src-supplier=Newark; ComponentLink3Description: https://datasheet.octopart.com:443/STM32F411CEU6-STMicroelectronics-datasheet-114750309.pdf?src-supplier=Newark; ComponentLink4URL: https://datasheet.octopart.com:443/STM32F411CEU6-STMicroelectronics-datasheet-34219326.pdf?src-supplier=Newark; ComponentLink4Description: https://datasheet.octopart.com:443/STM32F411CEU6-STMicroelectronics-datasheet-34219326.pdf?src-supplier=Newark; ComponentLink5URL: https://datasheet.octopart.com:443/STM32F411CEU6-STMicroelectronics-datasheet-82511007.pdf?src-supplier=SHENGYU+ELECTRONICS; ComponentLink5Description: https://datasheet.octopart.com:443/STM32F411CEU6-STMicroelectronics-datasheet-82511007.pdf?src-supplier=SHENGYU+ELECTRONICS
Y200 = 830055474: WE-XTAL Quartz Crystal, CFPX-180, 25MHz, +/-50ppm; Manufacturer: Wurth Elektronik; Frequency Stability: 50ppm; Load Capacitance: 16pF; Manufacturer Part Number: 830055474; Category: Crystals; Match Code: WE-XTAL; ComponentLink1Description: Website Link; ComponentLink1URL: https://www.we-online.com/redexpert/article/830055474?ad; ComponentLink2Description: Datasheet Link; ComponentLink2URL: https://www.we-online.com/redexpert/spec/830055474?ad; Mount: Surface Mount; Operating Temperature Min: -40degC; Operating Temperature Max: 85degC; Packaging: Tape and Reel; Case/Size Code: CFPX-180; Length: 3.2mm; Width: 2.5mm; Height: 0.8mm; Application: Processor, USB, 3G/4G/5G, Ethernet, Small Cell, PHY, PCI Express; Frequency: 25MHz; Frequency Tolerance: +/-50ppm